# Altium schematic sheet 2019电压基准.SchDoc
size A3
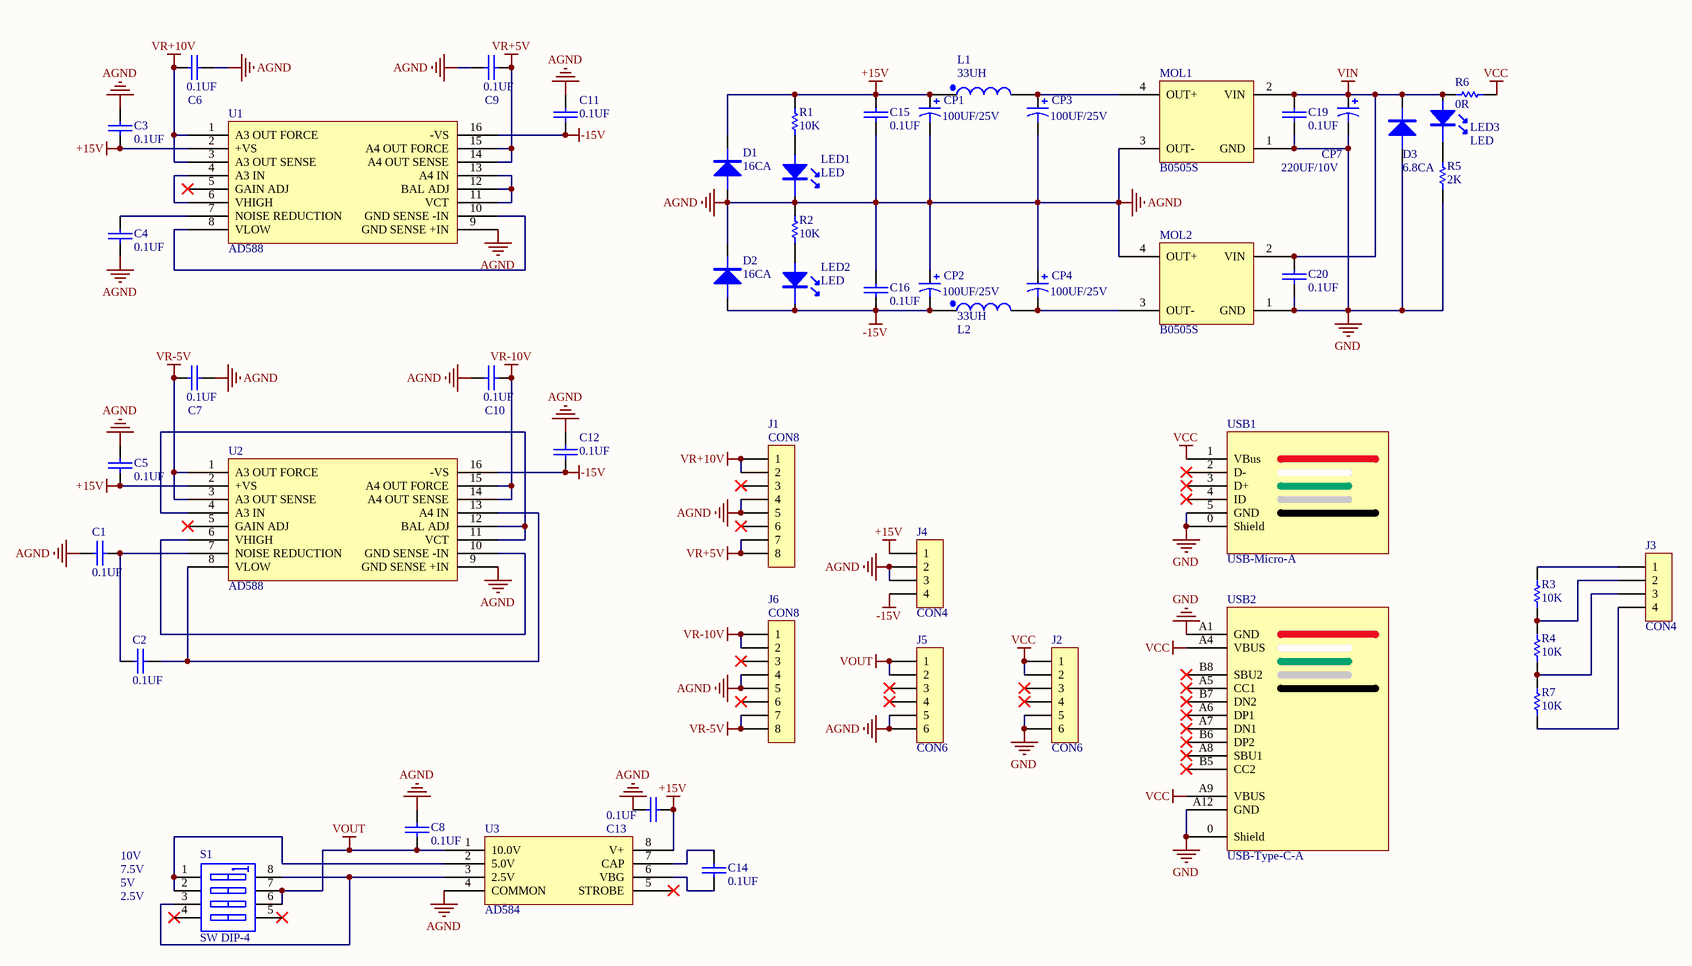
[diagram p0: 2019电压基准.SchDoc]

## Parts
C1  0.1UF  [cap-3]
C2  0.1UF  [cap-3]
C3  0.1UF  [CAP-3]
C4  0.1UF  [CAP-3]
C5  0.1UF  [cap-3]
C6  0.1UF  [CAP-3]
C7  0.1UF  [CAP-3]
C8  0.1UF  [CAP-3]
C9  0.1UF  [CAP-3]
C10  0.1UF  [CAP-3]
C11  0.1UF  [CAP-3]
C12  0.1UF  [cap-3]
C13  0.1UF  [CAP-3]
C14  0.1UF  [cap-3]
C15  0.1UF  [LC-0603-C]
C16  0.1UF  [LC-0603-C]
C19  0.1UF  [LC-0603-C]
C20  0.1UF  [LC-0603-C]
CP1  100UF/25V  [cap]
CP2  100UF/25V  [cap]
CP3  100UF/25V  [cap]
CP4  100UF/25V  [cap]
CP7  220UF/10V  [cap]
D1  16CA  [LC-SMA(DO-214AC)_S3]
D2  16CA  [LC-SMA(DO-214AC)_S3]
D3  6.8CA  [LC-SMA(DO-214AC)_S3]
J1  CON8  [sip-8]
J2  CON6  [sip-6]
J3  CON4  [sip-4]
J4  CON4  [sip-4]
J5  CON6  [sip-6]
J6  CON8  [sip-8]
L1  33UH  [lin6*6]
L2  33UH  [lin6*6]
LED1  LED  [lc-0603_LED_S5]
LED2  LED  [lc-0603_LED_S5]
LED3  LED  [lc-0603_LED_S5]
MOL1  B0505S  [B0505S]
MOL2  B0505S  [B0505S]
R1  10K  [LC-0603-R]
R2  10K  [LC-0603-R]
R3  10K  [fuse4]
R4  10K  [fuse4]
R5  2K  [LC-0603-R]
R6  0R  [LC-0805_L]
R7  10K  [fuse4]
S1  SW DIP-4  [stc-dip8-smd]
U1  AD588  [stc-dip16]
U2  AD588  [stc-dip16]
U3  AD584  [stc-dip8]
USB1  USB-Micro-A  [USB-MICRO-R]
USB2  USB-Type-C-A  [USB-Type-C-R]

## Nets
+15V: C3.1 C5.1 C13.1 C15.2 CP1.1 D1.2 J4.1 L1.1 R1.1 U1.2(+VS) U2.2(+VS) U3.8(V+)
-15V: C11.1 C12.1 C16.1 CP2.2 D2.1 J4.4 L2.1 LED2.K U1.16(-VS) U2.16(-VS)
AGND: C1.1 C3.2 C4.1 C5.2 C6.1 C7.2 C8.1 C9.2 C10.2 C11.2 C12.2 C13.2 C15.1 C16.2 CP1.2 CP2.1 CP3.2 CP4.1 D1.1 D2.2 J1.4 J1.5 J4.2 J4.3 J5.5 J5.6 J6.4 J6.5 LED1.K MOL1.3(OUT-) MOL2.4(OUT+) R2.1 U1.9(GND_SENSE_+IN) U2.9(GND_SENSE_+IN) U3.4(COMMON)
GND: C19.1 C20.1 CP7.2 D3.1 J2.5 J2.6 MOL1.1(GND) MOL2.1(GND) R5.1 USB1.0(Shield) USB1.5(GND) USB2.0(Shield) USB2.A1(GND) USB2.A12(GND)
VCC: J2.1 J2.2 R6.1 USB1.1(VBus) USB2.A4(VBUS) USB2.A9(VBUS)
VIN: C19.2 C20.2 CP7.1 D3.2 LED3.A MOL1.2(VIN) MOL2.2(VIN) R6.2
VOUT: C8.2 J5.1 J5.2 S1.6(B3) S1.7(B2) U3.1(10.0V)
VR+5V: C9.1 J1.7 J1.8 U1.14(A4_OUT_SENSE) U1.15(A4_OUT_FORCE)
VR+10V: C6.2 J1.1 J1.2 U1.1(A3_OUT_FORCE) U1.3(A3_OUT_SENSE)
VR-5V: C7.1 J6.7 J6.8 U2.1(A3_OUT_FORCE) U2.3(A3_OUT_SENSE)
VR-10V: C10.1 J6.1 J6.2 U2.14(A4_OUT_SENSE) U2.15(A4_OUT_FORCE)
NetC1_2: C1.2 C2.2 U2.7(NOISE_REDUCTION)
NetC2_1: C2.1 U2.8(VLOW) U2.13(A4_IN)
NetC4_2: C4.2 U1.7(NOISE_REDUCTION)
NetC14_1: C14.1 U3.7(CAP)
NetC14_2: C14.2 U3.6(VBG)
NetCP3_1: CP3.1 L1.2 MOL1.4(OUT+)
NetCP4_2: CP4.2 L2.2 MOL2.3(OUT-)
NetJ3_1: J3.1 R3.2
NetJ3_2: J3.2 R3.1 R4.2
NetJ3_3: J3.3 R4.1 R7.2
NetJ3_4: J3.4 R7.1
NetLED1_A: LED1.A R1.2
NetLED2_A: LED2.A R2.2
NetLED3_K: LED3.K R5.2
NetS1_1: S1.1(A1) S1.2(A2) U3.2(5.0V)
NetS1_3: S1.3(A3) S1.8(B1) U3.3(2.5V)
NetU1_4: U1.4(A3_IN) U1.6(VHIGH)
NetU1_8: U1.8(VLOW) U1.10(GND_SENSE_-IN)
NetU1_11: U1.11(VCT) U1.12(BAL_ADJ) U1.13(A4_IN)
NetU2_4: U2.4(A3_IN) U2.11(VCT) U2.12(BAL_ADJ)
NetU2_6: U2.6(VHIGH) U2.10(GND_SENSE_-IN)

Not connected (* = marked no-connect by the designer): J1 3* 6*; J2 3* 4*; J5 3* 4*; J6 3* 6*; S1 4(A4)* 5(B4)*; U1 5(GAIN_ADJ)*; U2 5(GAIN_ADJ)*; U3 5(STROBE)*; USB1 2(D-)* 3(D+)* 4(ID)*; USB2 A5(CC1)* A6(DP1)* A7(DN1)* A8(SBU1)* B5(CC2)* B6(DP2)* B7(DN2)* B8(SBU2)*

## Notes on the sheet
- 7.5V
- 5V
- 2.5V
- 10V

## Library data of the parts
C1-C16 C19 C20 = CAP
CP1-CP4 CP7 = CAP1
D1-D3 = DIODE
J1 J6 = CON8: Connector
J2 J5 = CON6: Connector
J3 J4 = CON4: Connector
L1 L2 = INDUCTOR
R1-R7 = RES
S1 = SW DIP-4: DIP Switch